# EAGLE design ec (EAGLE 7.5.0)
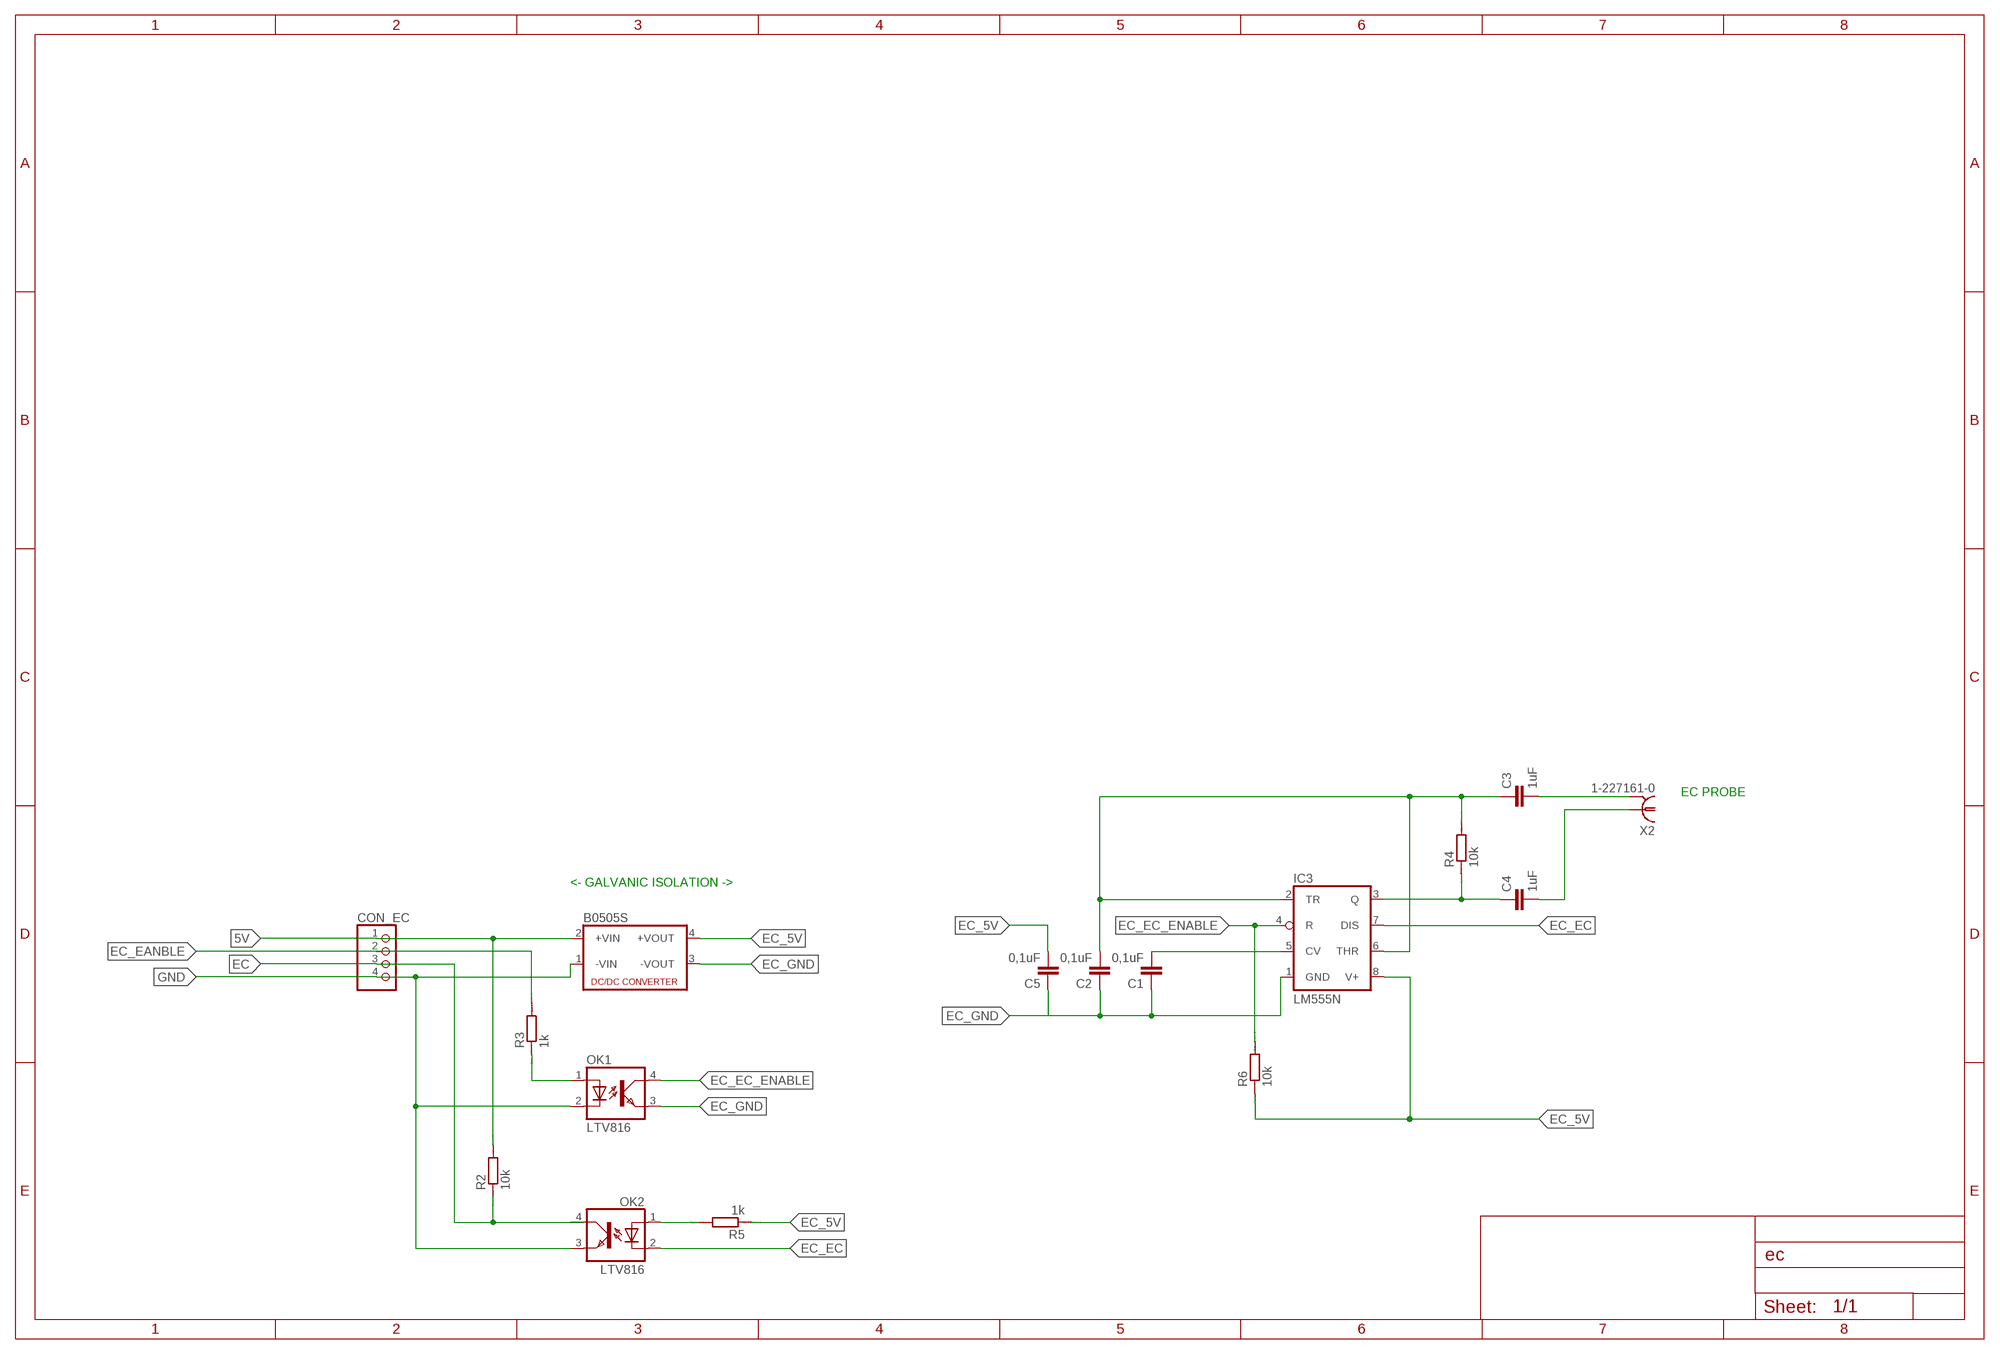
[diagram p0: schematic, sheet 1]

## Parts
B0505S  NME  [NME]
C1  0,1uF  C-EU050-024X044  [C050-024X044]
C2  0,1uF  C-EU050-024X044  [C050-024X044]
C3  1uF  C-EU050-024X044  [C050-024X044]
C4  1uF  C-EU050-024X044  [C050-024X044]
C5  0,1uF  C-EU050-024X044  [C050-024X044]
CON_EC  PINHD-1X4  [1X04]
IC3  LM555N  [DIL08]
OK1  LTV816  [DIL04]
OK2  LTV816  [DIL04]
R2  10k  R0207/10  [0207/10]
R3  1k  R0207/10  [0207/10]
R4  10k  R0207/10  [0207/10]
R5  1k  R0207/10  [0207/10]
R6  10k  R0207/10  [0207/10]
X2  1-227161-0  [AMP_227161]

## Nets
5V: B0505S.2(+VIN) CON_EC.1 R2.2
EC: CON_EC.3 OK2.4(COL) R2.1
EC_5V: B0505S.4(+VOUT) C5.2 IC3.8(V+) R5.1 R6.1
EC_EANBLE: CON_EC.2 R3.2
EC_EC: IC3.7(DIS) OK2.2(C)
EC_EC_ENABLE: IC3.4(R) OK1.4(COL) R6.2
EC_GND: B0505S.3(-VOUT) C1.1 C2.1 C5.1 IC3.1(GND) OK1.3(EMIT)
GND: B0505S.1(-VIN) CON_EC.4 OK1.2(C) OK2.3(EMIT)
N$5: C1.2 IC3.5(CV)
N$29: C3.2 X2.2
N$30: C2.2 C3.1 IC3.2(TR) IC3.6(THR) R4.2
N$31: OK1.1(A) R3.1
N$32: C4.1 IC3.3(Q) R4.1
N$33: OK2.1(A) R5.2
N$34: C4.2 X2.1

## Notes on the sheet
- EC PROBE
- <- GALVANIC ISOLATION ->

## Library data of the parts
B0505S = dc-dc-converter:NME: DC-DC CONVERTER; MF: C & D TECHNOLOGIES, INC; MPN: NME1205D; OC_FARNELL: 1021466; OC_NEWARK: 98B8198
C1-C5 = rcl:C-EU: CAPACITOR, European symbol
CON_EC = pinhead:PINHD-1X4: PIN HEADER
IC3 = linear:*555: TIMER
OK1 OK2 = optocoupler:LTV816: OPTO COUPLER Source: LITEON, LTV816.pdf; OC_FARNELL: unknown; OC_NEWARK: unknown
R2-R6 = eagle-ltspice:R: RESISTOR, European symbol; SPICEMODEL: NONE; SPICEPREFIX: R
X2 = con-coax:?227161*: JACK, RIGHT ANGLE, 50 OHM, PCB, BNC Source: amp_227161.pdf; MF: TYCO ELECTRONICS; MPN: 1-227161; OC_FARNELL: unknown; OC_NEWARK: 33B3200

## Board
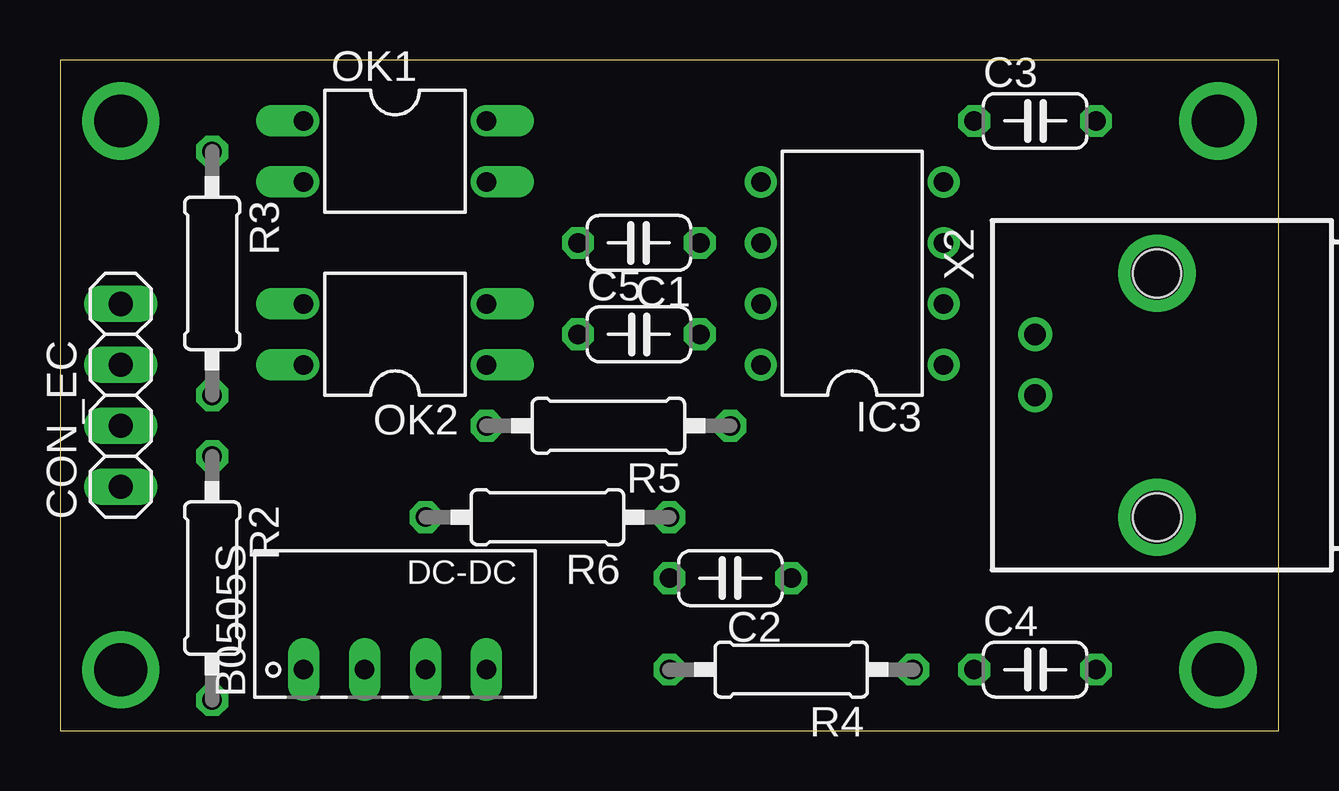
[diagram p1: board, top side]
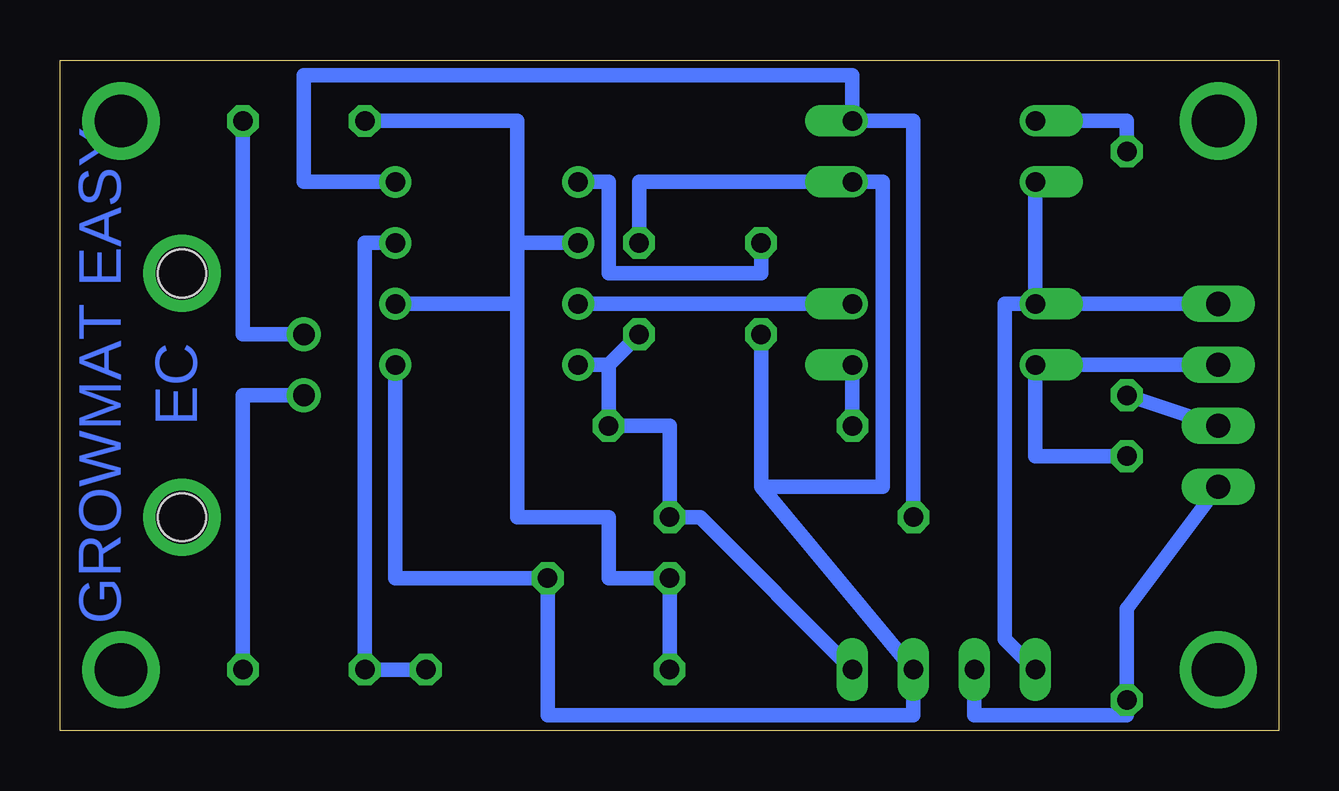
[diagram p2: board, bottom side, seen from below]

Size 50.79 x 27.94 mm. Coordinates in mm from the lower left corner, seen from the top.
Outline: 50.79,0 50.79,27.94 0,27.94 0,0 50.79,0
Copper layers (1*16): Top 0.035mm / dielectric 1.5mm / Bottom 0.035mm
Design rules "default": minimum track width 10mil, minimum drill 24mil, track to track 8mil, track to pad 8mil, pad to pad 8mil, via to via 8mil, smd to smd 8mil, copper to edge 40mil, drill to drill 8mil, minimum pad ring 10mil, minimum via ring 8mil, stop-mask expansion 4mil, vias tented up to drill 0mil, thermal gap 10mil

### Footprints (pad centres in the part's own frame; a part is rotated, then mirrored left to right if it is on the bottom)
NME = drill 0.813 long: 1 0,3.81; 2 0,1.27; 3 0,-1.27; 4 0,-3.81
C050-024X044 = drill 0.813 octagon: 1 -2.54,0; 2 2.54,0
1X04 = drill 1.016 long: 1 -3.81,0; 2 -1.27,0; 3 1.27,0; 4 3.81,0
DIL08 = drill 0.813 pad 1.27: 1 -3.81,-3.81; 2 -1.27,-3.81; 3 1.27,-3.81; 4 3.81,-3.81; 5 3.81,3.81; 6 1.27,3.81; 7 -1.27,3.81; 8 -3.81,3.81
DIL04 = drill 0.813 offset: 1 -1.27,-3.81; 2 1.27,-3.81; 3 1.27,3.81; 4 -1.27,3.81
0207/10 = drill 0.813 octagon: 1 -5.08,0; 2 5.08,0
AMP_227161 = drill 0.9 pad 1.27: 1 0,-5.08; 2 -2.54,-5.08 | hole 2: -5.08,0; 5.08,0

### Placement (x,y rotation side)
B0505S  13.96,2.54 90 top
C1  24.12,20.32 180 top
C2  27.93,6.35 180 top
C3  40.63,25.4 0 top
C4  40.63,2.54 0 top
C5  24.12,16.51 0 top
CON_EC  2.53,13.97 90 top
IC3  33.01,19.05 90 top
OK1  13.96,24.13 270 top
OK2  13.96,16.51 90 top
R2  6.34,6.35 270 top
R3  6.34,19.05 270 top
R4  30.47,2.54 180 top
R5  22.85,12.7 180 top
R6  20.31,8.89 180 top
X2  45.71,13.97 270 top

### Tracks (layer width: path | path; a pad name or v marks a point on that pad's centre or on a via)
5V
  Bottom 0.61: B0505S.2 12.69,0.64 6.34,0.64 R2.2 6.34,5.08 CON_EC.1
EC
  Bottom 0.61: R2.1 10.15,11.43 OK2.4 CON_EC.3
EC_5V
  Bottom 0.61: 27.93,15.24 R5.1 25.39,12.7 R6.1 24.12,8.89 B0505S.4 | IC3.8 27.93,15.24 | 27.93,15.24 C5.2
EC_EANBLE
  Bottom 0.61: CON_EC.2 R3.2
EC_EC
  Bottom 0.61: OK2.2 IC3.7
EC_EC_ENABLE
  Bottom 0.61: R6.2 15.23,25.4 OK1.4 17.77,27.3 40.63,27.3 40.63,22.86 IC3.4
EC_GND
  Bottom 0.61: C1.1 26.66,22.86 OK1.3 16.5,22.86 16.5,10.16 21.58,10.16 | 21.58,10.16 B0505S.3 15.23,0.64 30.47,0.64 C2.1 36.82,6.35 IC3.1 | C5.1 21.58,10.16
GND
  Bottom 0.61: B0505S.1 11.42,3.81 11.42,17.78 OK2.3 | OK2.3 OK1.2 | OK2.3 CON_EC.4
N$5
  Bottom 0.61: IC3.5 27.93,22.86 27.93,19.05 21.58,19.05 C1.2
N$29
  Bottom 0.61: X2.2 43.17,16.51 C3.2
N$30
  Bottom 0.61: R4.2 C2.2 27.93,6.35 27.93,8.89 31.74,8.89 31.74,17.78 | 31.74,17.78 IC3.2 | IC3.6 31.74,20.32 | C3.1 31.74,25.4 31.74,20.32 | 31.74,20.32 31.74,17.78
N$31
  Bottom 0.61: OK1.1 6.34,25.4 R3.1
N$32
  Bottom 0.61: R4.1 C4.1 38.09,20.32 IC3.3
N$33
  Bottom 0.61: OK2.1 R5.2
N$34
  Bottom 0.61: X2.1 43.17,13.97 C4.2
S$1  (via drill 2.2)
  other vias: 48.25,25.4 48.25,2.54 2.53,2.54 2.53,25.4 45.71,19.05 45.71,8.89

### Text on the board
Bottom: EC | GROWMAT EASY